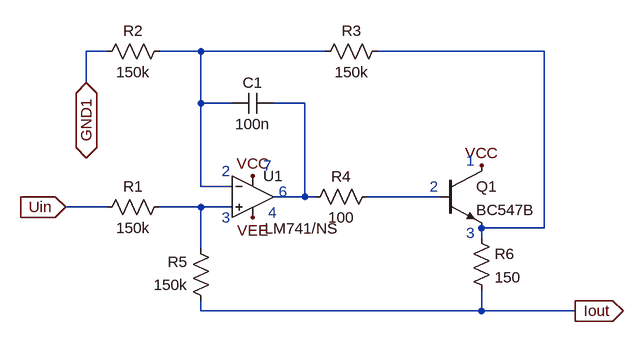
[diagram p0: schematic 2Viestinvalitys_lahetin.asc]
2Viestinvalitys_lahetin.asc, the LTspice schematic file:
Version 4.1
SHEET 1 1164 680
WIRE 144 -80 112 -80
WIRE 288 -80 224 -80
WIRE 480 -80 288 -80
WIRE 816 -80 560 -80
WIRE 112 -32 112 -80
WIRE 288 0 288 -80
WIRE 336 0 288 0
WIRE 448 0 400 0
WIRE 288 128 288 0
WIRE 336 128 288 128
WIRE 448 144 448 0
WIRE 448 144 400 144
WIRE 464 144 448 144
WIRE 656 144 544 144
WIRE 144 160 80 160
WIRE 288 160 224 160
WIRE 336 160 288 160
WIRE 816 192 816 -80
WIRE 816 192 720 192
WIRE 720 208 720 192
WIRE 288 224 288 160
WIRE 288 320 288 304
WIRE 720 320 720 288
WIRE 720 320 288 320
WIRE 864 320 720 320
FLAG 80 160 Uin
IOPIN 80 160 In
FLAG 368 112 VCC
FLAG 720 96 VCC
FLAG 368 176 VEE
FLAG 864 320 Iout
IOPIN 864 320 Out
FLAG 112 -32 GND1
IOPIN 112 -32 BiDir
SYMBOL res 240 144 R90
WINDOW 0 0 56 VBottom 2
WINDOW 3 32 56 VTop 2
SYMATTR InstName R1
SYMATTR Value 150k
SYMBOL OpAmps\\opamp2 368 80 R0
WINDOW 3 18 113 Left 2
SYMATTR Value LM741/NS
SYMATTR InstName U1
SYMBOL cap 400 -16 R90
WINDOW 0 0 32 VBottom 2
WINDOW 3 32 32 VTop 2
SYMATTR InstName C1
SYMATTR Value 100n
SYMBOL res 240 -96 R90
WINDOW 0 0 56 VBottom 2
WINDOW 3 32 56 VTop 2
SYMATTR InstName R2
SYMATTR Value 150k
SYMBOL res 576 -96 R90
WINDOW 0 0 56 VBottom 2
WINDOW 3 32 56 VTop 2
SYMATTR InstName R3
SYMATTR Value 150k
SYMBOL res 560 128 R90
WINDOW 0 0 56 VBottom 2
WINDOW 3 32 56 VTop 2
SYMATTR InstName R4
SYMATTR Value 100
SYMBOL res 304 320 R180
WINDOW 0 36 76 Left 2
WINDOW 3 36 40 Left 2
SYMATTR InstName R5
SYMATTR Value 150k
SYMBOL npn 656 96 R0
SYMATTR InstName Q1
SYMATTR Value BC547B
SYMBOL res 704 192 R0
SYMATTR InstName R6
SYMATTR Value 150
TEXT 320 104 Left 2 ;2
TEXT 320 176 Left 2 ;3
TEXT 408 136 Left 2 ;6
TEXT 384 96 Left 2 ;7
TEXT 392 168 Left 2 ;4
TEXT 640 128 Left 2 ;2
TEXT 696 200 Left 2 ;3
TEXT 696 88 Left 2 ;1

The netlist it stands for:
* 2Viestinvalitys_lahetin.asc
R1 N005 Uin 150k
X§U1 N005 N001 VCC VEE N003 LM741/NS  ; pins In+ In- V+ V- OUT
C1 N003 N001 100n
R2 N001 GND1 150k
R3 N002 N001 150k
R4 N004 N003 100
R5 Iout N005 150k
Q1 VCC N004 N002 0 BC547B
R6 N002 Iout 150
.model NPN NPN
.model PNP PNP
.lib standard.bjt
* 2
* 3
* 6
* 7
* 4
* 2
* 3
* 1
.backanno
.end